# Altium project YYB_Project1.PrjPcb
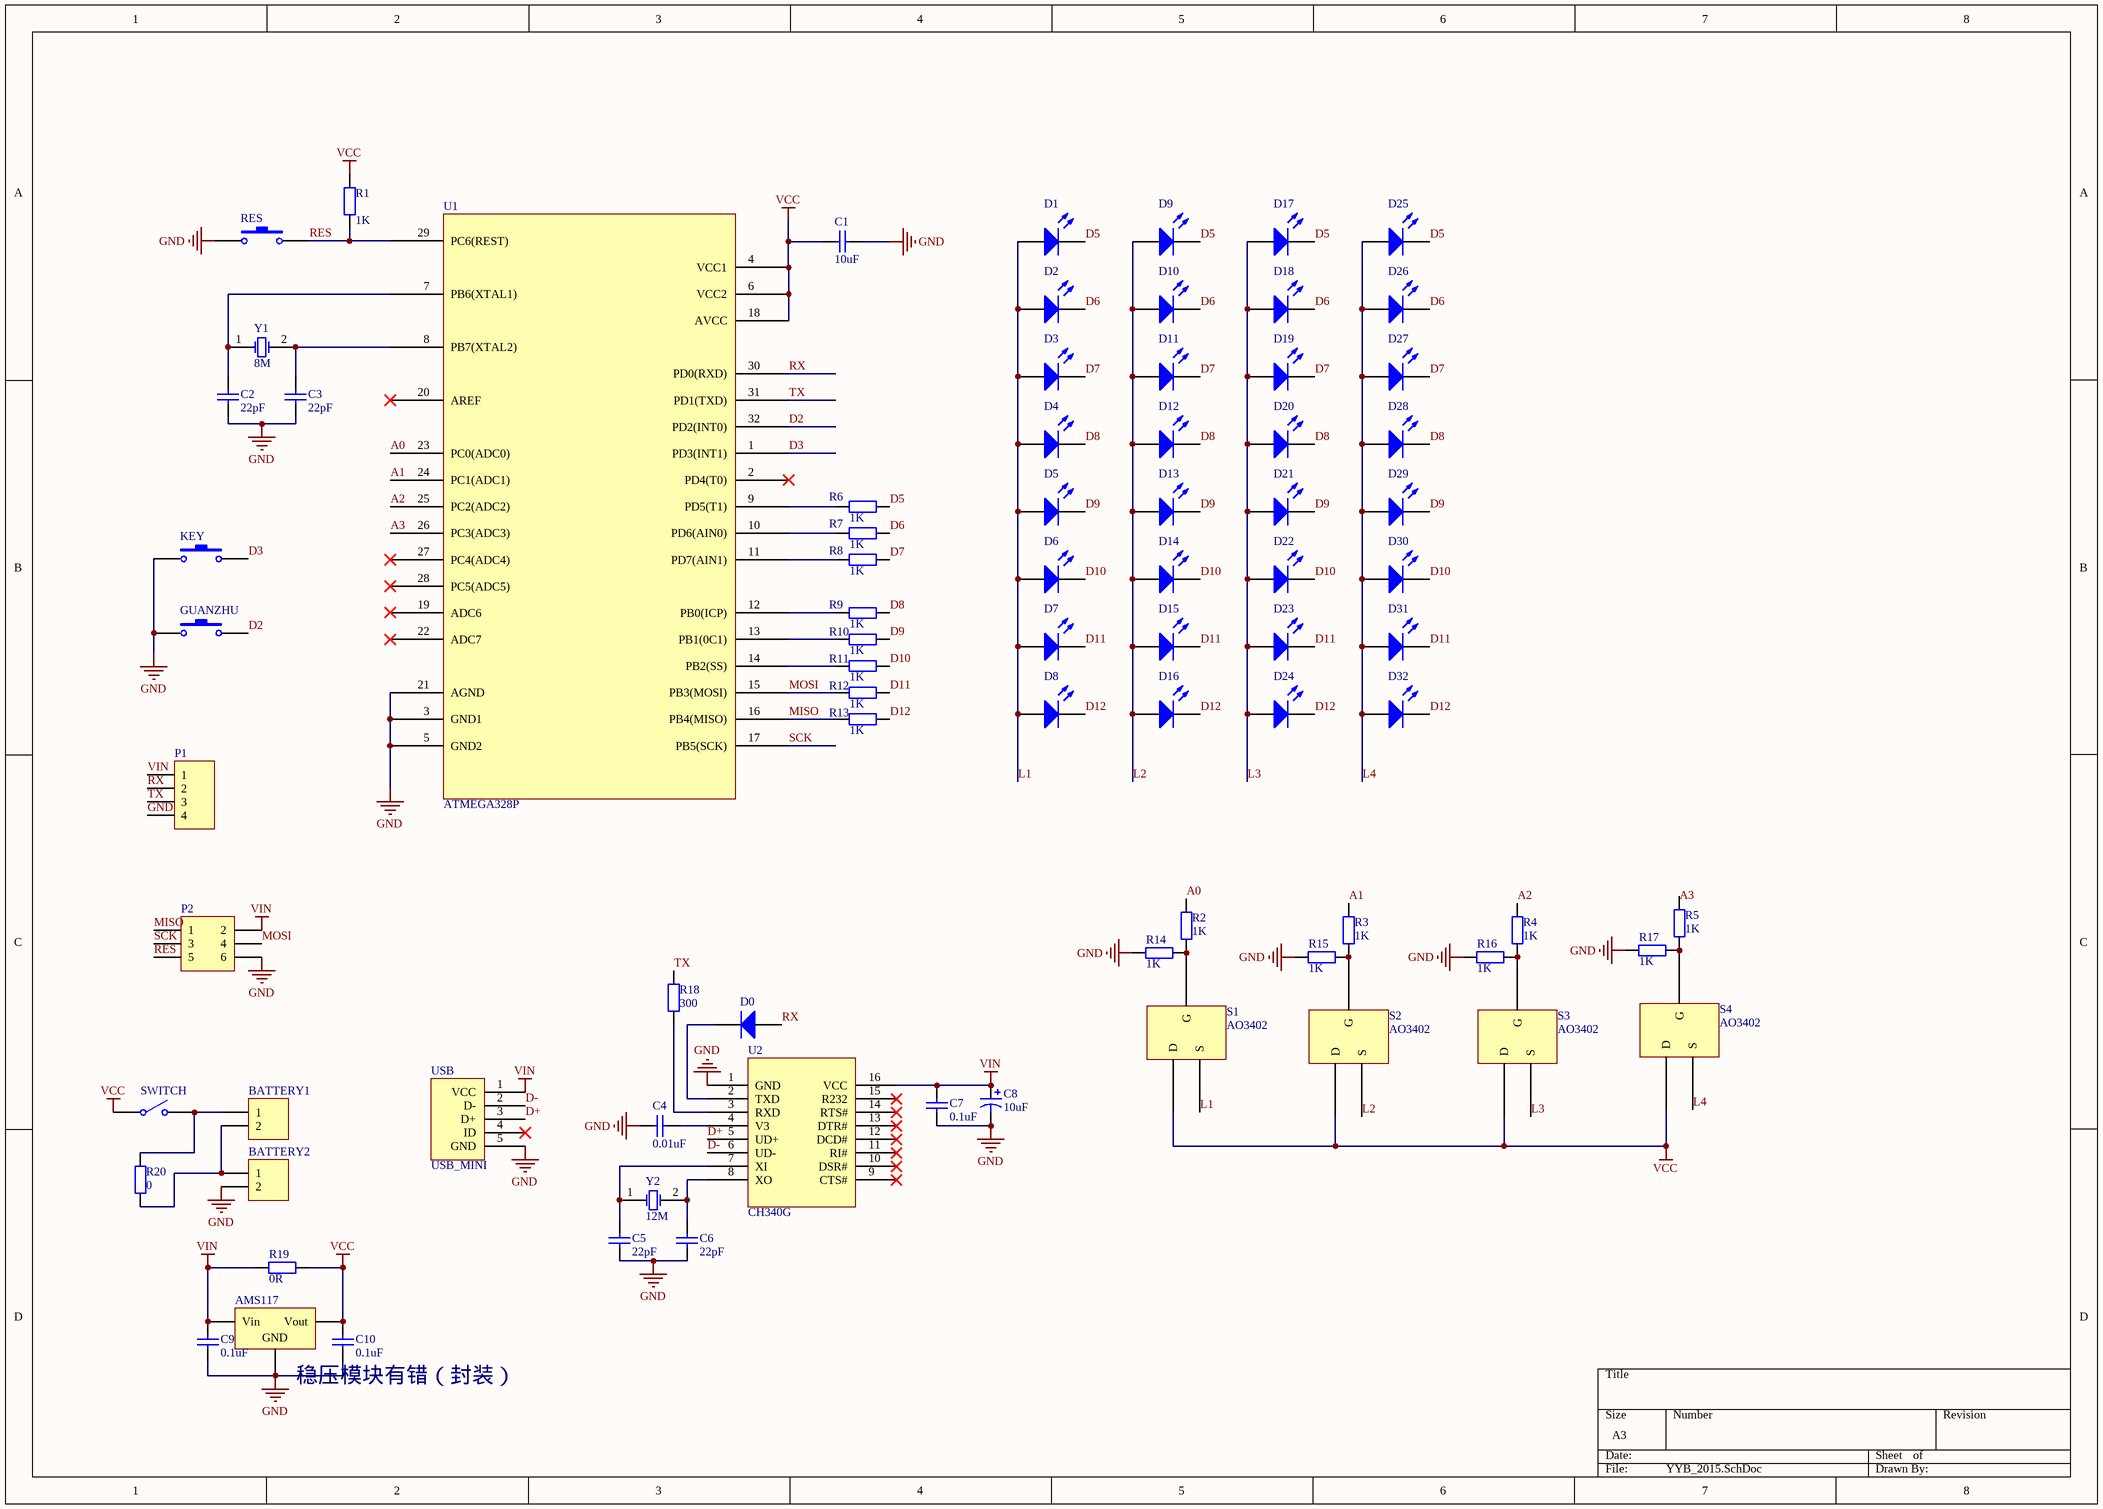
[diagram p0: YYB_2015.SchDoc]
5 sheets, 331 parts. Net scope: flat (ports and power ports of the same name join across sheets).
Board files: YYB_2015.PcbDoc, YYB_2016_2.PcbDoc, 三极管测试.PcbDoc, YYB_2016_2 电源不匹配问题解决.PcbDoc
Sheets:
  YYB_2015.SchDoc
  YYB2016_两节干电池.SchDoc
  三极管驱动电路.SchDoc
  YYB_2016_升压方案_否定.SchDoc
  YYB_供电不匹配解决.SchDoc

## Sheet YYB_2015.SchDoc
size A3

### Parts
(Parts that share a designator on the sheet are numbered #1, #2 ... from top to bottom, then left to right.)
AMS117  AMS117  [SOT223_M]  (value not drawn)
BATTERY1  Header 2  [PCBComponent_1 - duplicate1]  (value not drawn)
BATTERY2  Header 2  [PCBComponent_1 - duplicate1]  (value not drawn)
C1#1  value 10uF  [RES_0603]  (hidden comment: Cap)
C2#1  value 22pF  [RES_0603]  (hidden comment: Cap)
C3#1  value 22pF  [RES_0603]  (hidden comment: Cap)
C4  value 0.01uF  [RES_0603]  (hidden comment: Cap)
C5#1  value 22pF  [RES_0603]  (hidden comment: Cap)
C6#1  value 22pF  [RES_0603]  (hidden comment: Cap)
C7#1  value 0.1uF  [RES_0603]  (hidden comment: Cap)
C8#1  value 10uF  [10uf]  (hidden comment: Cap Pol1)
C9  value 0.1uF  [RES_0603]  (hidden comment: Cap)
C10  value 0.1uF  [RES_0603]  (hidden comment: Cap)
D0#1  Diode 1N4003  [MBR0520]  (value not drawn)
D1#1  LED0  [LED1210]  (value not drawn)
D2#1  LED0  [LED1210]  (value not drawn)
D3#1  LED0  [LED1210]  (value not drawn)
D4#1  LED0  [LED1210]  (value not drawn)
D5#1  LED0  [LED1210]  (value not drawn)
D6#1  LED0  [LED1210]  (value not drawn)
D7#1  LED0  [LED1210]  (value not drawn)
D8#1  LED0  [LED1210]  (value not drawn)
D9#1  LED0  [LED1210]  (value not drawn)
D10#1  LED0  [LED1210]  (value not drawn)
D11#1  LED0  [LED1210]  (value not drawn)
D12#1  LED0  [LED1210]  (value not drawn)
D13#1  LED0  [LED1210]  (value not drawn)
D14#1  LED0  [LED1210]  (value not drawn)
D15#1  LED0  [LED1210]  (value not drawn)
D16#1  LED0  [LED1210]  (value not drawn)
D17#1  LED0  [LED1210]  (value not drawn)
D18#1  LED0  [LED1210]  (value not drawn)
D19#1  LED0  [LED1210]  (value not drawn)
D20#1  LED0  [LED1210]  (value not drawn)
D21#1  LED0  [LED1210]  (value not drawn)
D22#1  LED0  [LED1210]  (value not drawn)
D23#1  LED0  [LED1210]  (value not drawn)
D24#1  LED0  [LED1210]  (value not drawn)
D25#1  LED0  [LED1210]  (value not drawn)
D26#1  LED0  [LED1210]  (value not drawn)
D27#1  LED0  [LED1210]  (value not drawn)
D28#1  LED0  [LED1210]  (value not drawn)
D29#1  LED0  [LED1210]  (value not drawn)
D30#1  LED0  [LED1210]  (value not drawn)
D31#1  LED0  [LED1210]  (value not drawn)
D32#1  LED0  [LED1210]  (value not drawn)
GUANZHU  SW-PB  [GUNZHU]  (value not drawn)
KEY  SW-PB  [KEY]  (value not drawn)
P1#1  Header 4  [HDR1X4]  (value not drawn)
P2  Header 3X2  [HDR2X3]  (value not drawn)
R1#1  value 1K  [RES_0603]  (hidden comment: Res2)
R2#1  value 1K  [RES_0603]  (hidden comment: Res2)
R3#1  value 1K  [RES_0603]  (hidden comment: Res2)
R4#1  value 1K  [RES_0603]  (hidden comment: Res2)
R5#1  value 1K  [RES_0603]  (hidden comment: Res2)
R6#1  value 1K  [RES_0603]  (hidden comment: Res2)
R7#1  value 1K  [RES_0603]  (hidden comment: Res2)
R8#1  value 1K  [RES_0603]  (hidden comment: Res2)
R9#1  value 1K  [RES_0603]  (hidden comment: Res2)
R10#1  value 1K  [RES_0603]  (hidden comment: Res2)
R11#1  value 1K  [RES_0603]  (hidden comment: Res2)
R12#1  value 1K  [RES_0603]  (hidden comment: Res2)
R13#1  value 1K  [RES_0603]  (hidden comment: Res2)
R14#1  value 1K  [RES_0603]  (hidden comment: Res2)
R15#1  value 1K  [RES_0603]  (hidden comment: Res2)
R16#1  value 1K  [RES_0603]  (hidden comment: Res2)
R17#1  value 1K  [RES_0603]  (hidden comment: Res2)
R18#1  value 300  [RES_0603]  (hidden comment: Res2)
R19#1  value 0R  [RES_0603]  (hidden comment: Res2)
R20#1  value 0  [RES_0603]  (hidden comment: Res2)
RES  SW-PB  [KEY]  (value not drawn)
S1  AO3402  [SOT23_M]
S2  AO3402  [SOT23_M]
S3  AO3402  [SOT23_M]
S4  AO3402  [SOT23_M]
SWITCH  SW-SPST  [SPST-2]  (value not drawn)
U1#1  ATMEGA328P  [328p]
U2#1  CH340G  [SO-16_N]
USB  USB_MINI  [USB_Micro]
Y1#1  8M  [XTAL_8M]
Y2  12M  [XTAL32_25]

### Nets
GND: AMS117.2(GND) BATTERY2.2 C1#1.2 C2#1.1 C3#1.1 C4.2 C5#1.1 C6#1.1 C7#1.1 C8#1.2 C9.1 C10.1 GUANZHU.1 KEY.1 P1#1.4 P2.6 R14#1.2 R15#1.2 R16#1.2 R17#1.2 RES.1 U1#1.3(GND1) U1#1.5(GND2) U1#1.21(AGND) U2#1.1(GND) USB.5(GND)
VCC: AMS117.3(Vout) C1#1.1 C10.2 R1#1.2 R19#1.2 S1.1(D) S2.1(D) S3.1(D) S4.1(D) SWITCH.1(COMMON) U1#1.4(VCC1) U1#1.6(VCC2) U1#1.18(AVCC)
VIN: AMS117.1(Vin) C7#1.2 C8#1.1 C9.2 P1#1.1 P2.2 R19#1.1 U2#1.16(VCC) USB.1(VCC)
A0: R2#1.2 U1#1.23(PC0(ADC0))
A1: R3#1.2 U1#1.24(PC1(ADC1))
A2: R4#1.2 U1#1.25(PC2(ADC2))
A3: U1#1.26(PC3(ADC3))
D2: GUANZHU.2 U1#1.32(PD2(INT0))
D3: KEY.2 U1#1.1(PD3(INT1))
D5: D1#1.2(K) D9#1.2(K) D17#1.2(K) D25#1.2(K) R6#1.2
D6: D2#1.2(K) D10#1.2(K) D18#1.2(K) D26#1.2(K) R7#1.2
D7: D3#1.2(K) D11#1.2(K) D19#1.2(K) D27#1.2(K) R8#1.2
D8: D4#1.2(K) D12#1.2(K) D20#1.2(K) D28#1.2(K) R9#1.2
D9: D5#1.2(K) D13#1.2(K) D21#1.2(K) D29#1.2(K) R10#1.2
D10: D6#1.2(K) D14#1.2(K) D22#1.2(K) D30#1.2(K) R11#1.2
D11: D7#1.2(K) D15#1.2(K) D23#1.2(K) D31#1.2(K) R12#1.2
D12: D8#1.2(K) D16#1.2(K) D24#1.2(K) D32#1.2(K) R13#1.2
D+: U2#1.5(UD+) USB.3(D+)
D-: U2#1.6(UD-) USB.2(D-)
L1: D1#1.1(A) D2#1.1(A) D3#1.1(A) D4#1.1(A) D5#1.1(A) D6#1.1(A) D7#1.1(A) D8#1.1(A) S1.2(S)
L2: D9#1.1(A) D10#1.1(A) D11#1.1(A) D12#1.1(A) D13#1.1(A) D14#1.1(A) D15#1.1(A) D16#1.1(A) S2.2(S)
L3: D17#1.1(A) D18#1.1(A) D19#1.1(A) D20#1.1(A) D21#1.1(A) D22#1.1(A) D23#1.1(A) D24#1.1(A) S3.2(S)
L4: D25#1.1(A) D26#1.1(A) D27#1.1(A) D28#1.1(A) D29#1.1(A) D30#1.1(A) D31#1.1(A) D32#1.1(A) S4.2(S)
MISO: P2.1 R13#1.1 U1#1.16(PB4(MISO))
MOSI: P2.4 R12#1.1 U1#1.15(PB3(MOSI))
RES: P2.5 R1#1.1 RES.2 U1#1.29(PC6(REST))
RX: D0#1.1(A) P1#1.2 U1#1.30(PD0(RXD))
SCK: P2.3 U1#1.17(PB5(SCK))
TX: P1#1.3 R18#1.1 U1#1.31(PD1(TXD))
NetBATTERY1_1: BATTERY1.1 R20#1.1 SWITCH.2(NO)
NetBATTERY1_2: BATTERY1.2 BATTERY2.1 R20#1.2
NetC2#1_2: C2#1.2 U1#1.7(PB6(XTAL1)) Y1#1.1(OSC1)
NetC3#1_2: C3#1.2 U1#1.8(PB7(XTAL2)) Y1#1.2(OSC2)
NetC4_1: C4.1 U2#1.4(V3)
NetC5#1_2: C5#1.2 U2#1.7(XI) Y2.1(OSC1)
NetC6#1_2: C6#1.2 U2#1.8(XO) Y2.2(OSC2)
NetD0#1_2: D0#1.2(K) U2#1.2(TXD)
NetR2#1_1: R2#1.1 R14#1.1 S1.3(G)
NetR3#1_1: R3#1.1 R15#1.1 S2.3(G)
NetR4#1_1: R4#1.1 R16#1.1 S3.3(G)
NetR5#1_1: R5#1.1 R17#1.1 S4.3(G)
NetR6#1_1: R6#1.1 U1#1.9(PD5(T1))
NetR7#1_1: R7#1.1 U1#1.10(PD6(AIN0))
NetR8#1_1: R8#1.1 U1#1.11(PD7(AIN1))
NetR9#1_1: R9#1.1 U1#1.12(PB0(ICP))
NetR10#1_1: R10#1.1 U1#1.13(PB1(0C1))
NetR11#1_1: R11#1.1 U1#1.14(PB2(SS))
NetR18#1_2: R18#1.2 U2#1.3(RXD)

Not connected (* = marked no-connect by the designer): R5#1 2; U1#1 2(PD4(T0))* 19(ADC6)* 20(AREF)* 22(ADC7)* 27(PC4(ADC4))* 28(PC5(ADC5))*; U2#1 9(CTS#)* 10(DSR#)* 11(RI#)* 12(DCD#)* 13(DTR#)* 14(RTS#)* 15(R232)*; USB 4(ID)*

### Notes on the sheet
- 稳压模块有错（封装）
- Labels drawn without touching a wire or pin: A3

### Library data of the parts
AMS117 = Volt Reg: Voltage Regulator; Published: 24-Mar-1999; LatestRevisionDate: 29-May-2009; LatestRevisionNote: IPC-7351 Footprint Added.; PackageReference: D2PAK; Publisher: Altium Limited; PackageDescription: 3-Pin Transistor Outline Package 2.54 mm Pitch, 15.1 mm Lead Span
BATTERY1 BATTERY2 = Header 2: Header, 2-Pin; LatestRevisionDate: 17-Jul-2002; LatestRevisionNote: Re-released for DXP Platform.; Publisher: Altium Limited
C1#1 C2#1 C3#1 C4 C5#1 C6#1 C7#1 C9 C10 = Cap: Capacitor; Published: 8-Jun-2000; LatestRevisionDate: 17-Jul-2002; LatestRevisionNote: Re-released for DXP Platform.; PackageReference: RAD-0.3; Publisher: Altium Limited; PackageDescription: Radial Cap, Thru-Hole; 2 Leads; 0.3 in Pin Spacing
C8#1 = Cap Pol1: Polarized Capacitor (Radial); Published: 8-Jun-2000; LatestRevisionDate: 17-Jul-2002; LatestRevisionNote: Re-released for DXP Platform.; PackageReference: RB7.6-15; Publisher: Altium Limited; PackageDescription: Polarized Capacitor (Radial); 2 Leads
D0#1 = Diode 1N4003: 1 Amp General Purpose Rectifier; Published: 8-Jun-2000; LatestRevisionDate: 17-Jul-2002; LatestRevisionNote: Re-released for DXP Platform.; DatasheetVersion: 1998; PackageVersion: Aug-1999; PackageReference: DO-41; Publisher: Altium Limited; PackageDescription: Diode, Axial; Body 5.2 x 2.7 mm (LxDia. max), Lead Dia. 0.86 mm (max); Code_JEDEC: DO-204-AL; ComponentLink1Description: Manufacturer Link; ComponentLink1URL: http://www.fairchildsemi.com/; ComponentLink2Description: Datasheet; ComponentLink2URL: http://www.fairchildsemi.com/ds/1N%2F1N4001.pdf
D1#1 D2#1 D3#1 D4#1 D5#1 D6#1 D7#1 D8#1 D9#1 D10#1 D11#1 D12#1 D13#1 D14#1 D15#1 D16#1 D17#1 D18#1 D19#1 D20#1 D21#1 D22#1 D23#1 D24#1 D25#1 D26#1 D27#1 D28#1 D29#1 D30#1 D31#1 D32#1 = LED0: Typical INFRARED GaAs LED; Published: 8-Jun-2000; LatestRevisionDate: 08-Jul-2005; LatestRevisionNote: Mech Layer 1 removed.; PackageReference: LED-0; Publisher: Altium Limited; PackageDescription: LED; 2 Leads
GUANZHU KEY RES = SW-PB: Switch; Published: 24-Mar-1999; LatestRevisionDate: 17-Jul-2002; LatestRevisionNote: Re-released for DXP Platform.; PackageReference: SPST-2; Publisher: Altium Limited; PackageDescription: Switch; 2 Leads
P1#1 = Header 4: Header, 4-Pin; LatestRevisionDate: 17-Jul-2002; LatestRevisionNote: Re-released for DXP Platform.; Publisher: Altium Limited
P2 = Header 3X2: Header, 3-Pin, Dual row; LatestRevisionDate: 17-Jul-2002; LatestRevisionNote: Re-released for DXP Platform.; Publisher: Altium Limited
R1#1 R2#1 R3#1 R4#1 R5#1 R6#1 R7#1 R8#1 R9#1 R10#1 R11#1 R12#1 R13#1 R14#1 R15#1 R16#1 R17#1 R18#1 R19#1 R20#1 = Res2: Resistor; Published: 8-Jun-2000; LatestRevisionDate: 17-Jul-2002; LatestRevisionNote: Re-released for DXP Platform.; PackageReference: AXIAL-0.4; Publisher: Altium Limited; PackageDescription: Axial Device, Thru-Hole; 2 Leads; 0.4 in Pin Spacing
SWITCH = SW-SPST: Single-Pole, Single-Throw Switch; Published: 24-Mar-1999; LatestRevisionDate: 17-Jul-2002; LatestRevisionNote: Re-released for DXP Platform.; PackageReference: SPST-2; Publisher: Altium Limited; PackageDescription: Switch; 2 Leads
Y1#1 Y2 = XTAL: Crystal Oscillator; Published: 8-Jun-2000; LatestRevisionDate: 17-Jul-2002; LatestRevisionNote: Re-released for DXP Platform.; PackageReference: R38; Publisher: Altium Limited; PackageDescription: Crystal, Thru-Hole; 2 Leads; Body 3.1 x 8.2 mm (Dia.xH)

## Sheet YYB2016_两节干电池.SchDoc
size A4
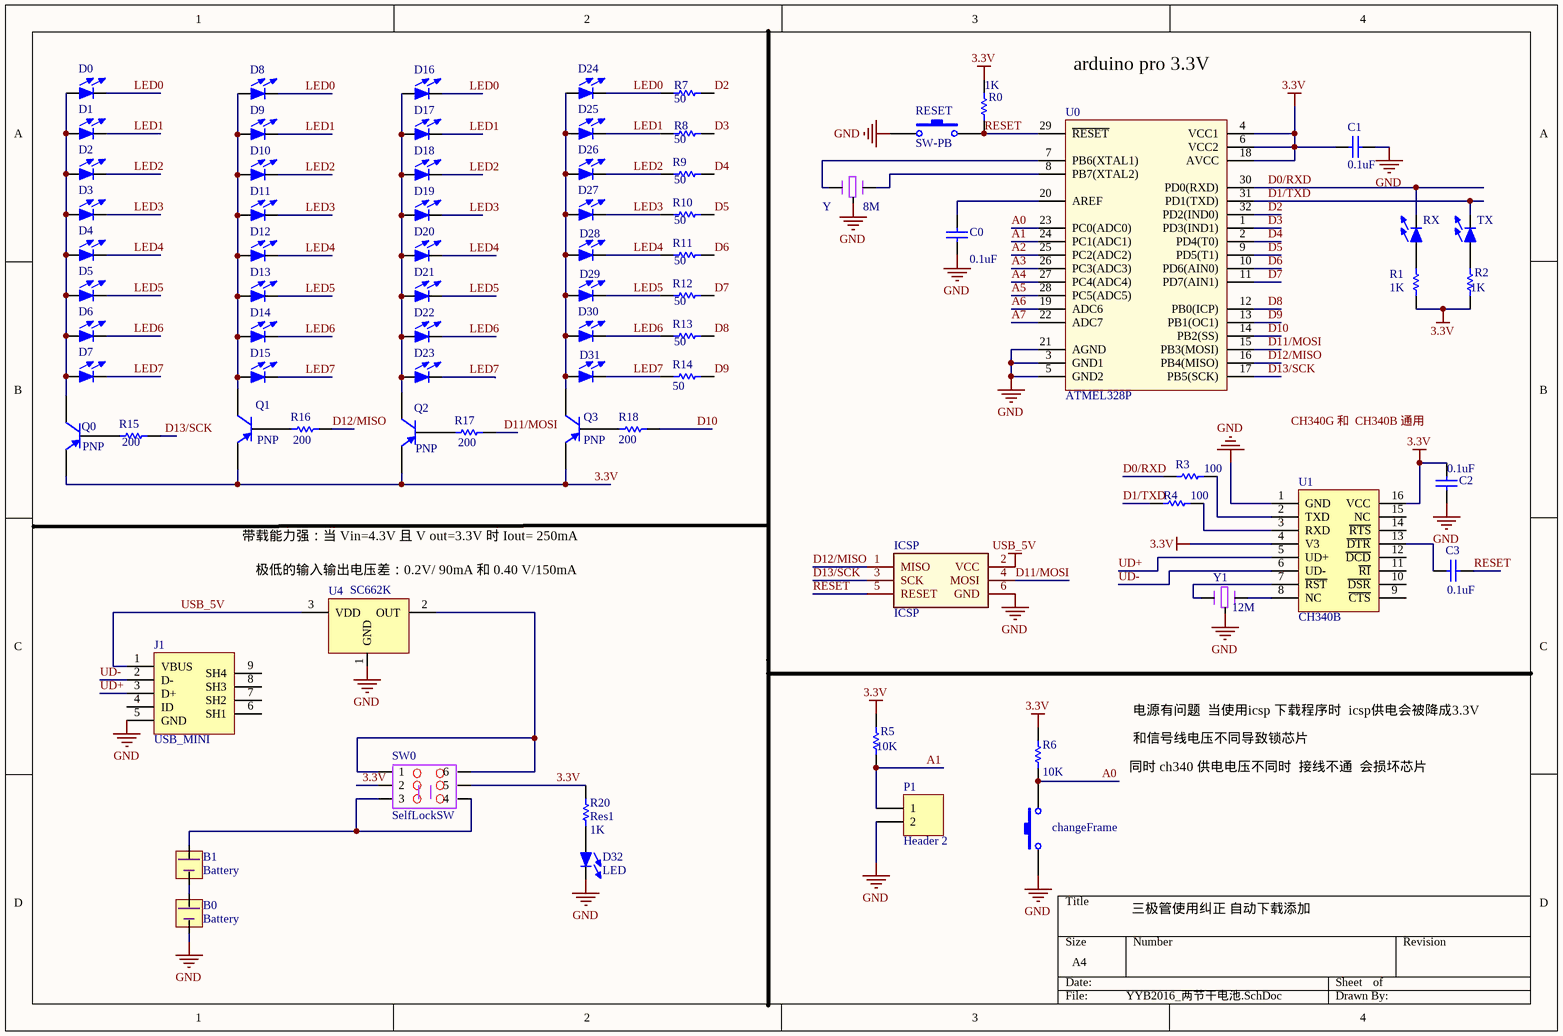
[diagram p1: YYB2016_两节干电池.SchDoc]

### Parts
(Parts that share a designator on the sheet are numbered #1, #2 ... from top to bottom, then left to right.)
B0#1  Battery  [BAT]
B1#1  Battery  [BAT]
C0#1  value 0.1uF  [6-0805_N]
C1#2  value 0.1uF  [6-0805_N]  (hidden comment: Cap)
C2#2  value 0.1uF  [6-0805_N]  (hidden comment: Cap)
C3#2  value 0.1uF  [6-0805_N]  (hidden comment: Cap)
changeFrame#1  SW-PB  [KEY_SODFL_2-Leads]  (value not drawn)
D0#2  (no value)  [LED_3528]
D1#2  (no value)  [LED_3528]
D2#2  (no value)  [LED_3528]
D3#2  (no value)  [LED_3528]
D4#2  (no value)  [LED_3528]
D5#2  (no value)  [LED_3528]
D6#2  (no value)  [LED_3528]
D7#2  (no value)  [LED_3528]
D8#2  (no value)  [LED_3528]
D9#2  (no value)  [LED_3528]
D10#2  (no value)  [LED_3528]
D11#2  (no value)  [LED_3528]
D12#2  (no value)  [LED_3528]
D13#2  (no value)  [LED_3528]
D14#2  (no value)  [LED_3528]
D15#2  (no value)  [LED_3528]
D16#2  (no value)  [LED_3528]
D17#2  (no value)  [LED_3528]
D18#2  (no value)  [LED_3528]
D19#2  (no value)  [LED_3528]
D20#2  (no value)  [LED_3528]
D21#2  (no value)  [LED_3528]
D22#2  (no value)  [LED_3528]
D23#2  (no value)  [LED_3528]
D24#2  (no value)  [LED_3528]
D25#2  (no value)  [LED_3528]
D26#2  (no value)  [LED_3528]
D27#2  (no value)  [LED_3528]
D28#2  (no value)  [LED_3528]
D29#2  (no value)  [LED_3528]
D30#2  (no value)  [LED_3528]
D31#2  (no value)  [LED_3528]
D32#2  LED  [LED_0805]
ICSP#1  ICSP  [HDR2X3]
J1#1  USB_MINI  [MICRO_USB]
P1#2  Header 2  [HDR1X2]
Q0#1  PNP  [PNP_SOT_23]
Q1#1  PNP  [PNP_SOT_23]
Q2#1  PNP  [PNP_SOT_23]
Q3#1  PNP  [PNP_SOT_23]
R0#1  value 1K  [6-0805_N]
R1#2  value 1K  [6-0805_N]  (hidden comment: Res1)
R2#2  value 1K  [6-0805_N]  (hidden comment: Res1)
R3#2  value 100  [6-0805_N]  (hidden comment: Res1)
R4#2  value 100  [6-0805_N]  (hidden comment: Res1)
R5#2  value 10K  [6-0805_N]  (hidden comment: Res1)
R6#2  value 10K  [6-0805_N]  (hidden comment: Res1)
R7#2  value 50  [6-0805_N]  (hidden comment: Res1)
R8#2  value 50  [6-0805_N]  (hidden comment: Res1)
R9#2  value 50  [6-0805_N]  (hidden comment: Res1)
R10#2  value 50  [6-0805_N]  (hidden comment: Res1)
R11#2  value 50  [6-0805_N]  (hidden comment: Res1)
R12#2  value 50  [6-0805_N]  (hidden comment: Res1)
R13#2  value 50  [6-0805_N]  (hidden comment: Res1)
R14#2  value 50  [6-0805_N]  (hidden comment: Res1)
R15#2  value 200  [6-0805_N]  (hidden comment: Res1)
R16#2  value 200  [6-0805_N]  (hidden comment: Res1)
R17#2  value 200  [6-0805_N]  (hidden comment: Res1)
R18#2  value 200  [6-0805_N]  (hidden comment: Res1)
R20#2  Res1  value 1K  [6-0805_N]
RESET#1  SW-PB  [KEY_SODFL_2-Leads]
RX#1  (no value)  [LED_0805]
SW0#1  SelfLockSW  [KEY_ZS_5.8*5.8]
TX#1  (no value)  [LED_0805]
U0#1  ATMEL328P  [TQFP 32]
U1#2  CH340B  [SOP16]
U4#1  SC662K  [SOT-23]
Y1#2  12M  [XTAL]
Y#1  8M  [XTAL]

### Nets
3.3V: C1#2.2 C2#2.2 Q0#1.2(E) Q1#1.2(E) Q2#1.2(E) Q3#1.2(E) R0#1.1 R1#2.1 R2#2.1 R5#2.2 R6#2.2 R20#2.2 SW0#1.2 SW0#1.5 U0#1.4(VCC1) U0#1.6(VCC2) U0#1.18(AVCC) U1#2.4(V3) U1#2.16(VCC)
GND: B0#1.2 C0#1.1 C1#2.1 C2#2.1 changeFrame#1.1 D32#2.2 ICSP#1.6(GND) J1#1.5(GND) P1#2.2 RESET#1.1 U0#1.3(GND1) U0#1.5(GND2) U0#1.21(AGND) U1#2.1(GND) U4#1.1(GND) Y1#2.2 Y#1.2
USB_5V: ICSP#1.2(VCC) J1#1.1(VBUS) U4#1.3(VDD)
A0: changeFrame#1.2 R6#2.1 U0#1.23(PC0(ADC0))
A1: P1#2.1 R5#2.1 U0#1.24(PC1(ADC1))
A2: U0#1.25(PC2(ADC2))
A3: U0#1.26(PC3(ADC3))
A4: U0#1.27(PC4(ADC4))
A5: U0#1.28(PC5(ADC5))
A6: U0#1.19(ADC6)
A7: U0#1.22(ADC7)
D0/RXD: R3#2.1 RX#1.2 U0#1.30(PD0(RXD))
D1/TXD: R4#2.1 TX#1.2 U0#1.31(PD1(TXD))
D2: R7#2.2 U0#1.32(PD2(IND0))
D3: R8#2.2 U0#1.1(PD3(IND1))
D4: R9#2.2 U0#1.2(PD4(T0))
D5: R10#2.2 U0#1.9(PD5(T1))
D6: R11#2.2 U0#1.10(PD6(AIN0))
D7: R12#2.2 U0#1.11(PD7(AIN1))
D8: R13#2.2 U0#1.12(PB0(ICP))
D9: R14#2.2 U0#1.13(PB1(OC1))
D10: R18#2.2 U0#1.14(PB2(SS))
D11/MOSI: ICSP#1.4(MOSI) R17#2.2 U0#1.15(PB3(MOSI))
D12/MISO: ICSP#1.1(MISO) R16#2.2 U0#1.16(PB4(MISO))
D13/SCK: ICSP#1.3(SCK) R15#2.2 U0#1.17(PB5(SCK))
LED0: D0#2.2 D8#2.2 D16#2.2 D24#2.2 R7#2.1
LED1: D1#2.2 D9#2.2 D17#2.2 D25#2.2 R8#2.1
LED2: D2#2.2 D10#2.2 D18#2.2 D26#2.2 R9#2.1
LED3: D3#2.2 D11#2.2 D19#2.2 D27#2.2 R10#2.1
LED4: D4#2.2 D12#2.2 D20#2.2 D28#2.2 R11#2.1
LED5: D5#2.2 D13#2.2 D21#2.2 D29#2.2 R12#2.1
LED6: D6#2.2 D14#2.2 D22#2.2 D30#2.2 R13#2.1
LED7: D7#2.2 D15#2.2 D23#2.2 D31#2.2 R14#2.1
RESET: C3#2.2 ICSP#1.5(RESET) R0#1.2 RESET#1.2 U0#1.29(~{RESET})
UD+: J1#1.3(D+) U1#2.5(UD+)
UD-: J1#1.2(D-) U1#2.6(UD-)
NetB0#1_1: B0#1.1(+) B1#1.2
NetB1#1_1: B1#1.1(+) SW0#1.3 SW0#1.4
NetC0#1_2: C0#1.2 U0#1.20(AREF)
NetC3#2_1: C3#2.1 U1#2.13(~{DTR})
NetD0#2_1: D0#2.1 D1#2.1 D2#2.1 D3#2.1 D4#2.1 D5#2.1 D6#2.1 D7#2.1 Q0#1.3(C)
NetD8#2_1: D8#2.1 D9#2.1 D10#2.1 D11#2.1 D12#2.1 D13#2.1 D14#2.1 D15#2.1 Q1#1.3(C)
NetD16#2_1: D16#2.1 D17#2.1 D18#2.1 D19#2.1 D20#2.1 D21#2.1 D22#2.1 D23#2.1 Q2#1.3(C)
NetD24#2_1: D24#2.1 D25#2.1 D26#2.1 D27#2.1 D28#2.1 D29#2.1 D30#2.1 D31#2.1 Q3#1.3(C)
NetD32#2_1: D32#2.1 R20#2.1
NetQ0#1_1: Q0#1.1(B) R15#2.1
NetQ1#1_1: Q1#1.1(B) R16#2.1
NetQ2#1_1: Q2#1.1(B) R17#2.1
NetQ3#1_1: Q3#1.1(B) R18#2.1
NetR1#2_2: R1#2.2 RX#1.1
NetR2#2_2: R2#2.2 TX#1.1
NetR3#2_2: R3#2.2 U1#2.2(TXD)
NetR4#2_2: R4#2.2 U1#2.3(RXD)
NetSW0#1_1: SW0#1.1 SW0#1.6 U4#1.2(OUT)
NetU0#1_7: U0#1.7(PB6(XTAL1)) Y#1.1
NetU0#1_8: U0#1.8(PB7(XTAL2)) Y#1.3
NetU1#2_7: U1#2.7(~{RST}) Y1#2.1
NetU1#2_8: U1#2.8(NC) Y1#2.3

Not connected (* = marked no-connect by the designer): J1#1 4(ID) 6(SH1) 7(SH2) 8(SH3) 9(SH4); U1#2 9(~{CTS}) 10(~{DSR}) 11(~{RI}) 12(~{DCD}) 14(~{RTS}) 15(NC)

### Notes on the sheet
- arduino pro 3.3V
- 带载能力强：当 Vin=4.3V 且 V out=3.3V 时 Iout= 250mA
- (near U4#1) 极低的输入输出电压差：0.2V/ 90mA 和 0.40 V/150mA
- 电源有问题  当使用icsp 下载程序时  icsp供电会被降成3.3V
- 同时 ch340 供电电压不同时  接线不通  会损坏芯片
- 和信号线电压不同导致锁芯片
- 三极管使用纠正 自动下载添加
- Labels drawn without touching a wire or pin: CH340G 和  CH340B 通用

### Library data of the parts
C0#1 C1#2 C2#2 C3#2 = Cap: Capacitor; Published: 8-Jun-2000; LatestRevisionDate: 17-Jul-2002; LatestRevisionNote: Re-released for DXP Platform.; PackageReference: RAD-0.3; Publisher: Altium Limited; PackageDescription: Radial Cap, Thru-Hole; 2 Leads; 0.3 in Pin Spacing
changeFrame#1 RESET#1 = SW-PB: Switch; Published: 24-Mar-1999; LatestRevisionDate: 17-Jul-2002; LatestRevisionNote: Re-released for DXP Platform.; PackageReference: SPST-2; Publisher: Altium Limited; PackageDescription: Switch; 2 Leads
D0#2 D1#2 D2#2 D3#2 D4#2 D5#2 D6#2 D7#2 D8#2 D9#2 D10#2 D11#2 D12#2 D13#2 D14#2 D15#2 D16#2 D17#2 D18#2 D19#2 D20#2 D21#2 D22#2 D23#2 D24#2 D25#2 D26#2 D27#2 D28#2 D29#2 D30#2 D31#2 RX#1 TX#1 = LED
P1#2 = Header 2: Header, 2-Pin; LatestRevisionDate: 17-Jul-2002; LatestRevisionNote: Re-released for DXP Platform.; Publisher: Altium Limited
Q0#1 Q1#1 Q2#1 Q3#1 = PNP: PNP Transistor; Published: 8-Jun-2000; LatestRevisionDate: 29-May-2009; LatestRevisionNote: IPC-7351 Footprint Added.; PackageVersion: Aug-1999; PackageReference: SOT-23B; Publisher: Altium Limited; PackageDescription: 3-Pin SOT-23 Package 0.95 mm Pitch, 2.4 mm Lead Span
R0#1 R1#2 R2#2 R3#2 R4#2 R5#2 R6#2 R7#2 R8#2 R9#2 R10#2 R11#2 R12#2 R13#2 R14#2 R15#2 R16#2 R17#2 R18#2 R20#2 = Res1: Resistor; Published: 8-Jun-2000; LatestRevisionDate: 17-Jul-2002; LatestRevisionNote: Re-released for DXP Platform.; PackageReference: AXIAL-0.3; Publisher: Altium Limited; PackageDescription: Axial Device, Thru-Hole; 2 Leads; 0.3 in Pin Spacing
SW0#1 = SelfLockSwitch: 自锁开关
U0#1 = ATMEL-328P
U1#2 = CH340B: usb to uart
U4#1 = SC662k-3.3V: 3.3V 稳压芯片
Y1#2 Y#1 = XTAL

## Sheet 三极管驱动电路.SchDoc
size A4
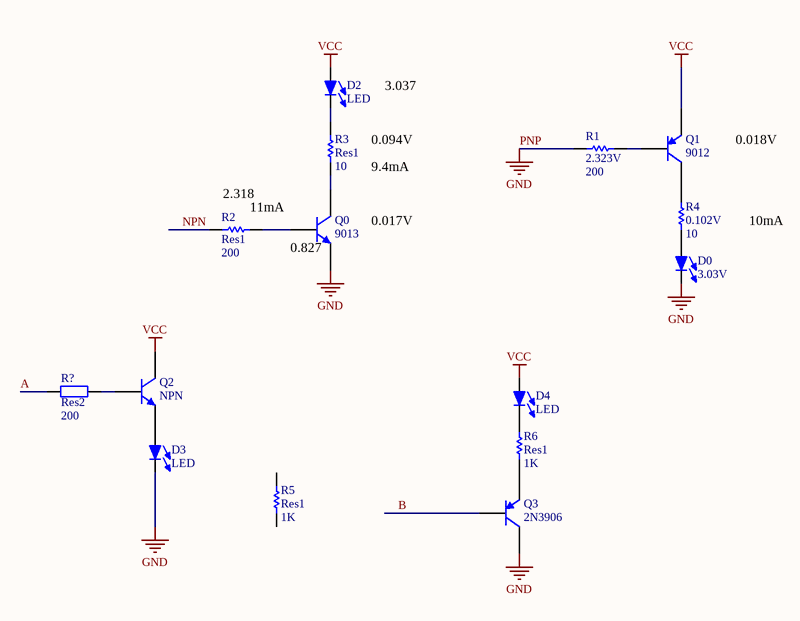
[diagram p2: 三极管驱动电路.SchDoc]

### Parts
(Parts that share a designator on the sheet are numbered #1, #2 ... from top to bottom, then left to right.)
D0#3  3.03V  [LED_3528]
D2#3  LED  [LED_3528]
D3#3  LED  [LED_3528]
D4#3  LED  [LED_3528]
Q0#2  9013  [TO-226-AA]
Q1#2  9012  [TO-92A]
Q2#2  NPN  [TO-226-AA]
Q3#2  2N3906  [TO-92A]
R1#3  2.323V  value 200  [6-0805_N]
R2#3  Res1  value 200  [6-0805_N]
R3#3  Res1  value 10  [6-0805_N]
R4#3  0.102V  value 10  [6-0805_N]
R5#3  Res1  value 1K  [6-0805_N]
R6#3  Res1  value 1K  [6-0805_N]
R?  Res2  value 200  [6-0805_N]

### Nets
GND: D0#3.2 D3#3.2 Q0#2.3(E) Q3#2.3(C) R1#3.1  [also labelled PNP]
VCC: D2#3.1 D4#3.1 Q1#2.1(E) Q2#2.1(C)
A: R?.1
B: Q3#2.2(B)
NPN: R2#3.1
NetD0#3_1: D0#3.1 R4#3.1
NetD2#3_2: D2#3.2 R3#3.2
NetD3#3_1: D3#3.1 Q2#2.3(E)
NetD4#3_2: D4#3.2 R6#3.2
NetQ0#2_1: Q0#2.1(C) R3#3.1
NetQ0#2_2: Q0#2.2(B) R2#3.2
NetQ1#2_2: Q1#2.2(B) R1#3.2
NetQ1#2_3: Q1#2.3(C) R4#3.2
NetQ2#2_2: Q2#2.2(B) R?.2
NetQ3#2_1: Q3#2.1(E) R6#3.1

Not connected (* = marked no-connect by the designer): R5#3 1 2

### Notes on the sheet
- 0.094V
- 3.037
- 0.018V
- (near R2#3) 2.318
- (near R2#3) 11mA
- 9.4mA
- (near Q0#2) 0.827
- (near Q0#2) 0.017V
- 10mA

### Library data of the parts
D0#3 = LED
Q0#2 Q2#2 = NPN: NPN Bipolar Transistor; Published: 8-Jun-2000; LatestRevisionDate: 17-Jul-2002; LatestRevisionNote: Re-released for DXP Platform.; PackageReference: TO-226-AA; Publisher: Altium Limited; PackageDescription: TO, Flat Index; 3 In-Line, Axial Leads; Body Dia. 4.8mm; Leads 0.55 x 0.51 mm (max); Code_JEDEC: TO-226-AA
Q1#2 Q3#2 = 2N3906: PNP General Purpose Amplifier; Published: 8-Jun-2000; LatestRevisionDate: 15-Jan-2003; LatestRevisionNote: PCB Footprint 'BCY-W3/D4.7' replaced; DatasheetVersion: 1997; PackageVersion: Sep-1998; PackageReference: TO-92A; Publisher: Altium Limited; PackageDescription: TO, Flat Index; 3 In-Line, Axial Leads; Body Dia. 4.5mm; Leads 0.51 x 0.48 mm (max); ComponentLink1Description: Manufacturer Link; ComponentLink1URL: http://www.fairchildsemi.com/; ComponentLink2Description: Datasheet; ComponentLink2URL: http://www.fairchildsemi.com/ds/2N%2F2N3906.pdf
R1#3 R2#3 R3#3 R4#3 R5#3 R6#3 = Res1: Resistor; Published: 8-Jun-2000; LatestRevisionDate: 17-Jul-2002; LatestRevisionNote: Re-released for DXP Platform.; PackageReference: AXIAL-0.3; Publisher: Altium Limited; PackageDescription: Axial Device, Thru-Hole; 2 Leads; 0.3 in Pin Spacing
R? = Res2: Resistor; Published: 8-Jun-2000; LatestRevisionDate: 17-Jul-2002; LatestRevisionNote: Re-released for DXP Platform.; PackageReference: AXIAL-0.4; Publisher: Altium Limited; PackageDescription: Axial Device, Thru-Hole; 2 Leads; 0.4 in Pin Spacing

## Sheet YYB_2016_升压方案_否定.SchDoc
size A4
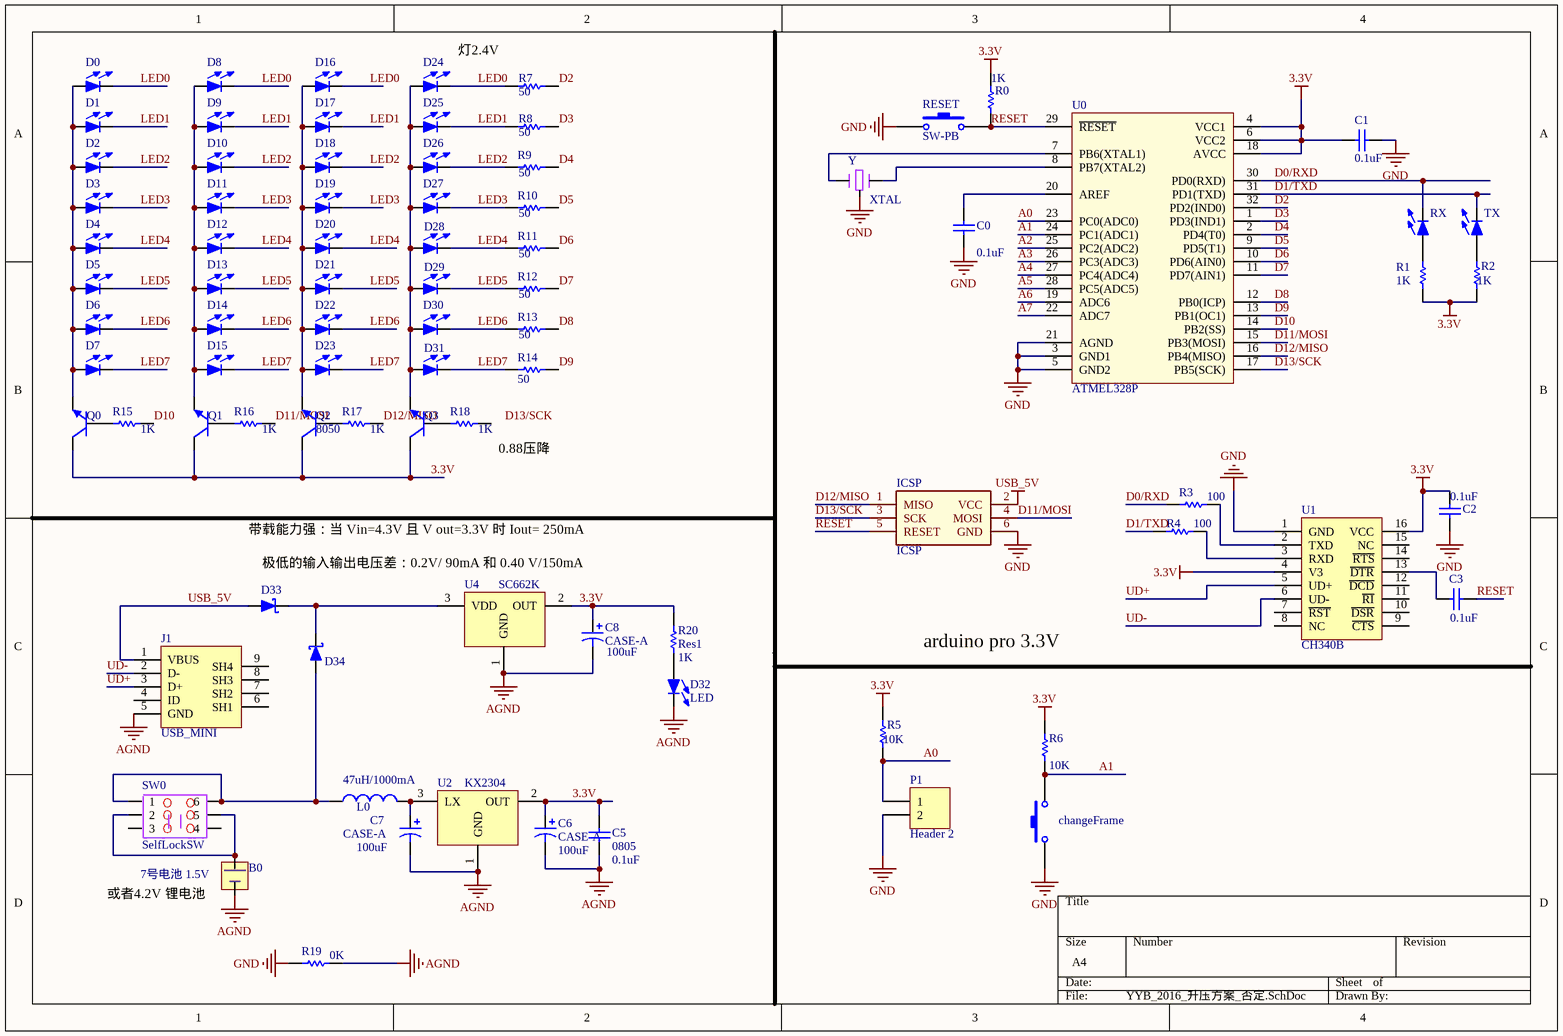
[diagram p3: YYB_2016_升压方案_否定.SchDoc]

### Parts
(Parts that share a designator on the sheet are numbered #1, #2 ... from top to bottom, then left to right.)
B0#2  7号电池 1.5V  [BAT]
C0#2  value 0.1uF  [6-0805_N]
C1#3  value 0.1uF  [6-0805_N]  (hidden comment: Cap)
C2#3  value 0.1uF  [6-0805_N]  (hidden comment: Cap)
C3#3  value 0.1uF  [6-0805_N]  (hidden comment: Cap)
C5#2  0805  value 0.1uF  [6-0805_N]
C6#2  CASE-A  value 100uF  [CASE-A_3216]
C7#2  CASE-A  value 100uF  [CASE-A_3216]
C8#2  CASE-A  value 100uF  [CASE-A_3216]
changeFrame#2  SW-PB  [KEY_SODFL_2-Leads]  (value not drawn)
D0#4  (no value)  [LED_3528]
D1#3  (no value)  [LED_3528]
D2#4  (no value)  [LED_3528]
D3#4  (no value)  [LED_3528]
D4#4  (no value)  [LED_3528]
D5#3  (no value)  [LED_3528]
D6#3  (no value)  [LED_3528]
D7#3  (no value)  [LED_3528]
D8#3  (no value)  [LED_3528]
D9#3  (no value)  [LED_3528]
D10#3  (no value)  [LED_3528]
D11#3  (no value)  [LED_3528]
D12#3  (no value)  [LED_3528]
D13#3  (no value)  [LED_3528]
D14#3  (no value)  [LED_3528]
D15#3  (no value)  [LED_3528]
D16#3  (no value)  [LED_3528]
D17#3  (no value)  [LED_3528]
D18#3  (no value)  [LED_3528]
D19#3  (no value)  [LED_3528]
D20#3  (no value)  [LED_3528]
D21#3  (no value)  [LED_3528]
D22#3  (no value)  [LED_3528]
D23#3  (no value)  [LED_3528]
D24#3  (no value)  [LED_3528]
D25#3  (no value)  [LED_3528]
D26#3  (no value)  [LED_3528]
D27#3  (no value)  [LED_3528]
D28#3  (no value)  [LED_3528]
D29#3  (no value)  [LED_3528]
D30#3  (no value)  [LED_3528]
D31#3  (no value)  [LED_3528]
D32#3  LED  [LED_0805]
D33  Diode-Schottky  [Diode-Schottky]  (value not drawn)
D34  Diode-Schottky  [Diode-Schottky]  (value not drawn)
ICSP#2  ICSP  [HDR2X3]
J1#2  USB_MINI  [MICRO_USB]
L0  value 47uH/1000mA  [0402-A]  (hidden comment: Inductor)
P1#3  Header 2  [HDR1X2]
Q0#3  transistor  [SOT-23]  (value not drawn)
Q1#3  transistor  [SOT-23]  (value not drawn)
Q2#3  8050  [SOT-23]
Q3#3  transistor  [SOT-23]  (value not drawn)
R0#2  value 1K  [6-0805_N]
R1#4  value 1K  [6-0805_N]  (hidden comment: Res1)
R2#4  value 1K  [6-0805_N]  (hidden comment: Res1)
R3#4  value 100  [6-0805_N]  (hidden comment: Res1)
R4#4  value 100  [6-0805_N]  (hidden comment: Res1)
R5#4  value 10K  [6-0805_N]  (hidden comment: Res1)
R6#4  value 10K  [6-0805_N]  (hidden comment: Res1)
R7#3  value 50  [6-0805_N]  (hidden comment: Res1)
R8#3  value 50  [6-0805_N]  (hidden comment: Res1)
R9#3  value 50  [6-0805_N]  (hidden comment: Res1)
R10#3  value 50  [6-0805_N]  (hidden comment: Res1)
R11#3  value 50  [6-0805_N]  (hidden comment: Res1)
R12#3  value 50  [6-0805_N]  (hidden comment: Res1)
R13#3  value 50  [6-0805_N]  (hidden comment: Res1)
R14#3  value 50  [6-0805_N]  (hidden comment: Res1)
R15#3  value 1K  [6-0805_N]  (hidden comment: Res1)
R16#3  value 1K  [6-0805_N]  (hidden comment: Res1)
R17#3  value 1K  [6-0805_N]  (hidden comment: Res1)
R18#3  value 1K  [6-0805_N]  (hidden comment: Res1)
R19#2  value 0K  [6-0805_N]  (hidden comment: Res1)
R20#3  Res1  value 1K  [6-0805_N]
RESET#2  SW-PB  [KEY_SODFL_2-Leads]
RX#2  (no value)  [LED_0805]
SW0#2  SelfLockSW  [KEY_ZS_8*8]
TX#2  (no value)  [LED_0805]
U0#2  ATMEL328P  [TQFP 32]
U1#3  CH340B  [SOP16]
U2#2  KX2304  [SOT89N]
U4#2  SC662K  [SOT-23]
Y#2  XTAL  [XTAL]

### Nets
3.3V: C1#3.2 C2#3.2 C5#2.2 C6#2.1 C8#2.1 Q0#3.3(C) Q1#3.3(C) Q2#3.3(C) Q3#3.3(C) R0#2.1 R1#4.1 R2#4.1 R5#4.2 R6#4.2 R20#3.2 U0#2.4(VCC1) U0#2.6(VCC2) U0#2.18(AVCC) U1#3.4(V3) U1#3.16(VCC) U2#2.2(OUT) U4#2.2(OUT)
AGND: B0#2.2 C5#2.1 C6#2.2 C7#2.2 C8#2.2 D32#3.2 J1#2.5(GND) R19#2.2 U2#2.1(GND) U4#2.1(GND)
GND: C0#2.1 C1#3.1 C2#3.1 changeFrame#2.1 ICSP#2.6(GND) P1#3.2 R19#2.1 RESET#2.1 U0#2.3(GND1) U0#2.5(GND2) U0#2.21(AGND) U1#3.1(GND) Y#2.2
USB_5V: D33.1 ICSP#2.2(VCC) J1#2.1(VBUS)
A0: P1#3.1 R5#4.1 U0#2.23(PC0(ADC0))
A1: changeFrame#2.2 R6#4.1 U0#2.24(PC1(ADC1))
A2: U0#2.25(PC2(ADC2))
A3: U0#2.26(PC3(ADC3))
A4: U0#2.27(PC4(ADC4))
A5: U0#2.28(PC5(ADC5))
A6: U0#2.19(ADC6)
A7: U0#2.22(ADC7)
D0/RXD: R3#4.1 RX#2.2 U0#2.30(PD0(RXD))
D1/TXD: R4#4.1 TX#2.2 U0#2.31(PD1(TXD))
D2: R7#3.2 U0#2.32(PD2(IND0))
D3: R8#3.2 U0#2.1(PD3(IND1))
D4: R9#3.2 U0#2.2(PD4(T0))
D5: R10#3.2 U0#2.9(PD5(T1))
D6: R11#3.2 U0#2.10(PD6(AIN0))
D7: R12#3.2 U0#2.11(PD7(AIN1))
D8: R13#3.2 U0#2.12(PB0(ICP))
D9: R14#3.2 U0#2.13(PB1(OC1))
D10: R15#3.2 U0#2.14(PB2(SS))
D11/MOSI: ICSP#2.4(MOSI) R16#3.2 U0#2.15(PB3(MOSI))
D12/MISO: ICSP#2.1(MISO) R17#3.2 U0#2.16(PB4(MISO))
D13/SCK: ICSP#2.3(SCK) U0#2.17(PB5(SCK))
LED0: D0#4.2 D8#3.2 D16#3.2 D24#3.2 R7#3.1
LED1: D1#3.2 D9#3.2 D17#3.2 D25#3.2 R8#3.1
LED2: D2#4.2 D10#3.2 D18#3.2 D26#3.2 R9#3.1
LED3: D3#4.2 D11#3.2 D19#3.2 D27#3.2 R10#3.1
LED4: D4#4.2 D12#3.2 D20#3.2 D28#3.2 R11#3.1
LED5: D5#3.2 D13#3.2 D21#3.2 D29#3.2 R12#3.1
LED6: D6#3.2 D14#3.2 D22#3.2 D30#3.2 R13#3.1
LED7: D7#3.2 D15#3.2 D23#3.2 D31#3.2 R14#3.1
RESET: C3#3.2 ICSP#2.5(RESET) R0#2.2 RESET#2.2 U0#2.29(~{RESET})
UD+: J1#2.3(D+) U1#3.5(UD+)
UD-: J1#2.2(D-) U1#3.6(UD-)
NetB0#2_1: B0#2.1(+) SW0#2.2 SW0#2.5
NetC0#2_2: C0#2.2 U0#2.20(AREF)
NetC3#3_1: C3#3.1 U1#3.13(~{DTR})
NetC7#2_1: C7#2.1 L0.2 U2#2.3(LX)
NetD0#4_1: D0#4.1 D1#3.1 D2#4.1 D3#4.1 D4#4.1 D5#3.1 D6#3.1 D7#3.1 Q0#3.2(E)
NetD8#3_1: D8#3.1 D9#3.1 D10#3.1 D11#3.1 D12#3.1 D13#3.1 D14#3.1 D15#3.1 Q1#3.2(E)
NetD16#3_1: D16#3.1 D17#3.1 D18#3.1 D19#3.1 D20#3.1 D21#3.1 D22#3.1 D23#3.1 Q2#3.2(E)
NetD24#3_1: D24#3.1 D25#3.1 D26#3.1 D27#3.1 D28#3.1 D29#3.1 D30#3.1 D31#3.1 Q3#3.2(E)
NetD32#3_1: D32#3.1 R20#3.1
NetD33_2: D33.2 D34.2 U4#2.3(VDD)
NetD34_1: D34.1 L0.1 SW0#2.1 SW0#2.6
NetQ0#3_1: Q0#3.1(B) R15#3.1
NetQ1#3_1: Q1#3.1(B) R16#3.1
NetQ2#3_1: Q2#3.1(B) R17#3.1
NetQ3#3_1: Q3#3.1(B) R18#3.1
NetR1#4_2: R1#4.2 RX#2.1
NetR2#4_2: R2#4.2 TX#2.1
NetR3#4_2: R3#4.2 U1#3.2(TXD)
NetR4#4_2: R4#4.2 U1#3.3(RXD)
NetU0#2_7: U0#2.7(PB6(XTAL1)) Y#2.1
NetU0#2_8: U0#2.8(PB7(XTAL2)) Y#2.3

Not connected (* = marked no-connect by the designer): J1#2 4(ID) 6(SH1) 7(SH2) 8(SH3) 9(SH4); R18#3 2; SW0#2 3 4; U1#3 7(~{RST}) 8(NC) 9(~{CTS}) 10(~{DSR}) 11(~{RI}) 12(~{DCD}) 14(~{RTS}) 15(NC)

### Notes on the sheet
- 灯2.4V
- (near R18#3) 0.88压降
- 带载能力强：当 Vin=4.3V 且 V out=3.3V 时 Iout= 250mA
- 极低的输入输出电压差：0.2V/ 90mA 和 0.40 V/150mA
- arduino pro 3.3V
- 或者4.2V 锂电池
- Labels drawn without touching a wire or pin: D13/SCK

### Library data of the parts
B0#2 = Battery
C0#2 C1#3 C2#3 C3#3 C5#2 = Cap: Capacitor; Published: 8-Jun-2000; LatestRevisionDate: 17-Jul-2002; LatestRevisionNote: Re-released for DXP Platform.; PackageReference: RAD-0.3; Publisher: Altium Limited; PackageDescription: Radial Cap, Thru-Hole; 2 Leads; 0.3 in Pin Spacing
C6#2 C7#2 C8#2 = Cap Pol1: Polarized Capacitor (Radial); Published: 8-Jun-2000; LatestRevisionDate: 17-Jul-2002; LatestRevisionNote: Re-released for DXP Platform.; PackageReference: RB7.6-15; Publisher: Altium Limited; PackageDescription: Polarized Capacitor (Radial); 2 Leads
changeFrame#2 RESET#2 = SW-PB: Switch; Published: 24-Mar-1999; LatestRevisionDate: 17-Jul-2002; LatestRevisionNote: Re-released for DXP Platform.; PackageReference: SPST-2; Publisher: Altium Limited; PackageDescription: Switch; 2 Leads
D0#4 D1#3 D2#4 D3#4 D4#4 D5#3 D6#3 D7#3 D8#3 D9#3 D10#3 D11#3 D12#3 D13#3 D14#3 D15#3 D16#3 D17#3 D18#3 D19#3 D20#3 D21#3 D22#3 D23#3 D24#3 D25#3 D26#3 D27#3 D28#3 D29#3 D30#3 D31#3 RX#2 TX#2 = LED
L0 = Inductor: Code_IEC: 1005; Published: 8-Jun-2000; LatestRevisionDate: 29-May-2009; LatestRevisionNote: IPC-7351 Footprint Added.; PackageReference: 0402-A; Publisher: Altium Limited; PackageDescription: Chip Inductor; Code_JEITA: 0402
P1#3 = Header 2: Header, 2-Pin; LatestRevisionDate: 17-Jul-2002; LatestRevisionNote: Re-released for DXP Platform.; Publisher: Altium Limited
Q2#3 = transistor
R0#2 R1#4 R2#4 R3#4 R4#4 R5#4 R6#4 R7#3 R8#3 R9#3 R10#3 R11#3 R12#3 R13#3 R14#3 R15#3 R16#3 R17#3 R18#3 R19#2 R20#3 = Res1: Resistor; Published: 8-Jun-2000; LatestRevisionDate: 17-Jul-2002; LatestRevisionNote: Re-released for DXP Platform.; PackageReference: AXIAL-0.3; Publisher: Altium Limited; PackageDescription: Axial Device, Thru-Hole; 2 Leads; 0.3 in Pin Spacing
SW0#2 = SelfLockSwitch: 自锁开关
U0#2 = ATMEL-328P
U1#3 = CH340B: usb to uart
U4#2 = SC662k-3.3V: 3.3V 稳压芯片

## Sheet YYB_供电不匹配解决.SchDoc
size A4
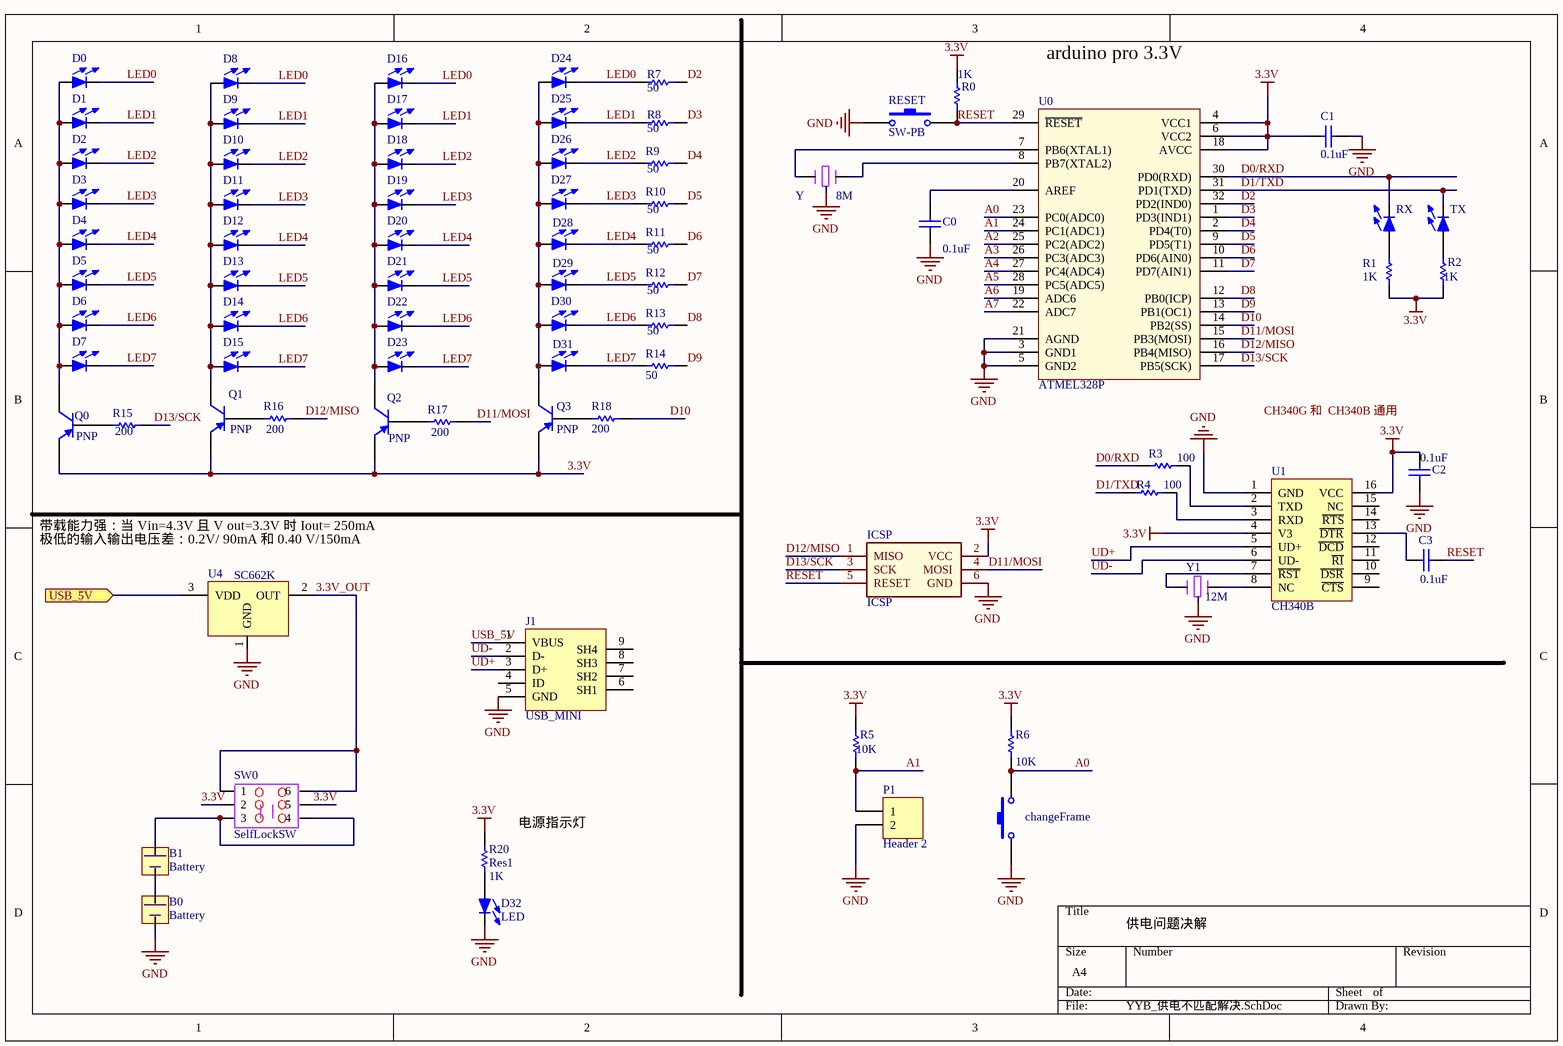
[diagram p4: YYB_供电不匹配解决.SchDoc]

### Parts
(Parts that share a designator on the sheet are numbered #1, #2 ... from top to bottom, then left to right.)
B0#3  Battery  [BAT]
B1#2  Battery  [BAT]
C0#3  value 0.1uF  [6-0805_N]
C1#4  value 0.1uF  [6-0805_N]  (hidden comment: Cap)
C2#4  value 0.1uF  [6-0805_N]  (hidden comment: Cap)
C3#4  value 0.1uF  [6-0805_N]  (hidden comment: Cap)
changeFrame#3  SW-PB  [KEY_SODFL_2-Leads]  (value not drawn)
D0#5  (no value)  [LED_3528]
D1#4  (no value)  [LED_3528]
D2#5  (no value)  [LED_3528]
D3#5  (no value)  [LED_3528]
D4#5  (no value)  [LED_3528]
D5#4  (no value)  [LED_3528]
D6#4  (no value)  [LED_3528]
D7#4  (no value)  [LED_3528]
D8#4  (no value)  [LED_3528]
D9#4  (no value)  [LED_3528]
D10#4  (no value)  [LED_3528]
D11#4  (no value)  [LED_3528]
D12#4  (no value)  [LED_3528]
D13#4  (no value)  [LED_3528]
D14#4  (no value)  [LED_3528]
D15#4  (no value)  [LED_3528]
D16#4  (no value)  [LED_3528]
D17#4  (no value)  [LED_3528]
D18#4  (no value)  [LED_3528]
D19#4  (no value)  [LED_3528]
D20#4  (no value)  [LED_3528]
D21#4  (no value)  [LED_3528]
D22#4  (no value)  [LED_3528]
D23#4  (no value)  [LED_3528]
D24#4  (no value)  [LED_3528]
D25#4  (no value)  [LED_3528]
D26#4  (no value)  [LED_3528]
D27#4  (no value)  [LED_3528]
D28#4  (no value)  [LED_3528]
D29#4  (no value)  [LED_3528]
D30#4  (no value)  [LED_3528]
D31#4  (no value)  [LED_3528]
D32#4  LED  [LED_0805]
ICSP#3  ICSP  [HDR2X3]
J1#3  USB_MINI  [MICRO_USB]
P1#4  Header 2  [HDR1X2]
Q0#4  PNP  [PNP_SOT_23]
Q1#4  PNP  [PNP_SOT_23]
Q2#4  PNP  [PNP_SOT_23]
Q3#4  PNP  [PNP_SOT_23]
R0#3  value 1K  [6-0805_N]
R1#5  value 1K  [6-0805_N]  (hidden comment: Res1)
R2#5  value 1K  [6-0805_N]  (hidden comment: Res1)
R3#5  value 100  [6-0805_N]  (hidden comment: Res1)
R4#5  value 100  [6-0805_N]  (hidden comment: Res1)
R5#5  value 10K  [6-0805_N]  (hidden comment: Res1)
R6#5  value 10K  [6-0805_N]  (hidden comment: Res1)
R7#4  value 50  [6-0805_N]  (hidden comment: Res1)
R8#4  value 50  [6-0805_N]  (hidden comment: Res1)
R9#4  value 50  [6-0805_N]  (hidden comment: Res1)
R10#4  value 50  [6-0805_N]  (hidden comment: Res1)
R11#4  value 50  [6-0805_N]  (hidden comment: Res1)
R12#4  value 50  [6-0805_N]  (hidden comment: Res1)
R13#4  value 50  [6-0805_N]  (hidden comment: Res1)
R14#4  value 50  [6-0805_N]  (hidden comment: Res1)
R15#4  value 200  [6-0805_N]  (hidden comment: Res1)
R16#4  value 200  [6-0805_N]  (hidden comment: Res1)
R17#4  value 200  [6-0805_N]  (hidden comment: Res1)
R18#4  value 200  [6-0805_N]  (hidden comment: Res1)
R20#4  Res1  value 1K  [6-0805_N]
RESET#3  SW-PB  [KEY_SODFL_2-Leads]
RX#3  (no value)  [LED_0805]
SW0#3  SelfLockSW  [KEY_ZS_5.8*5.8]
TX#3  (no value)  [LED_0805]
U0#3  ATMEL328P  [TQFP 32]
U1#4  CH340B  [SOP16]
U4#3  SC662K  [SOT-23]
Y1#3  12M  [XTAL]
Y#3  8M  [XTAL]

### Ports
USB_5V (in)

### Nets
3.3V: C1#4.2 C2#4.2 ICSP#3.2(VCC) Q0#4.2(E) Q1#4.2(E) Q2#4.2(E) Q3#4.2(E) R0#3.1 R1#5.1 R2#5.1 R5#5.2 R6#5.2 R20#4.2 SW0#3.2 SW0#3.5 U0#3.4(VCC1) U0#3.6(VCC2) U0#3.18(AVCC) U1#4.4(V3) U1#4.16(VCC)
GND: B0#3.2 C0#3.1 C1#4.1 C2#4.1 changeFrame#3.1 D32#4.2 ICSP#3.6(GND) J1#3.5(GND) P1#4.2 RESET#3.1 U0#3.3(GND1) U0#3.5(GND2) U0#3.21(AGND) U1#4.1(GND) U4#3.1(GND) Y1#3.2 Y#3.2
3.3V_OUT: SW0#3.1 SW0#3.6 U4#3.2(OUT)
A0: changeFrame#3.2 R6#5.1 U0#3.23(PC0(ADC0))
A1: P1#4.1 R5#5.1 U0#3.24(PC1(ADC1))
A2: U0#3.25(PC2(ADC2))
A3: U0#3.26(PC3(ADC3))
A4: U0#3.27(PC4(ADC4))
A5: U0#3.28(PC5(ADC5))
A6: U0#3.19(ADC6)
A7: U0#3.22(ADC7)
D0/RXD: R3#5.1 RX#3.2 U0#3.30(PD0(RXD))
D1/TXD: R4#5.1 TX#3.2 U0#3.31(PD1(TXD))
D2: R7#4.2 U0#3.32(PD2(IND0))
D3: R8#4.2 U0#3.1(PD3(IND1))
D4: R9#4.2 U0#3.2(PD4(T0))
D5: R10#4.2 U0#3.9(PD5(T1))
D6: R11#4.2 U0#3.10(PD6(AIN0))
D7: R12#4.2 U0#3.11(PD7(AIN1))
D8: R13#4.2 U0#3.12(PB0(ICP))
D9: R14#4.2 U0#3.13(PB1(OC1))
D10: R18#4.2 U0#3.14(PB2(SS))
D11/MOSI: ICSP#3.4(MOSI) R17#4.2 U0#3.15(PB3(MOSI))
D12/MISO: ICSP#3.1(MISO) R16#4.2 U0#3.16(PB4(MISO))
D13/SCK: ICSP#3.3(SCK) R15#4.2 U0#3.17(PB5(SCK))
LED0: D0#5.2 D8#4.2 D16#4.2 D24#4.2 R7#4.1
LED1: D1#4.2 D9#4.2 D17#4.2 D25#4.2 R8#4.1
LED2: D2#5.2 D10#4.2 D18#4.2 D26#4.2 R9#4.1
LED3: D3#5.2 D11#4.2 D19#4.2 D27#4.2 R10#4.1
LED4: D4#5.2 D12#4.2 D20#4.2 D28#4.2 R11#4.1
LED5: D5#4.2 D13#4.2 D21#4.2 D29#4.2 R12#4.1
LED6: D6#4.2 D14#4.2 D22#4.2 D30#4.2 R13#4.1
LED7: D7#4.2 D15#4.2 D23#4.2 D31#4.2 R14#4.1
RESET: C3#4.2 ICSP#3.5(RESET) R0#3.2 RESET#3.2 U0#3.29(~{RESET})
UD+: J1#3.3(D+) U1#4.5(UD+)
UD-: J1#3.2(D-) U1#4.6(UD-)
USB_5V: J1#3.1(VBUS)
NetB0#3_1: B0#3.1(+) B1#2.2
NetB1#2_1: B1#2.1(+) SW0#3.3 SW0#3.4
NetC0#3_2: C0#3.2 U0#3.20(AREF)
NetC3#4_1: C3#4.1 U1#4.13(~{DTR})
NetD0#5_1: D0#5.1 D1#4.1 D2#5.1 D3#5.1 D4#5.1 D5#4.1 D6#4.1 D7#4.1 Q0#4.3(C)
NetD8#4_1: D8#4.1 D9#4.1 D10#4.1 D11#4.1 D12#4.1 D13#4.1 D14#4.1 D15#4.1 Q1#4.3(C)
NetD16#4_1: D16#4.1 D17#4.1 D18#4.1 D19#4.1 D20#4.1 D21#4.1 D22#4.1 D23#4.1 Q2#4.3(C)
NetD24#4_1: D24#4.1 D25#4.1 D26#4.1 D27#4.1 D28#4.1 D29#4.1 D30#4.1 D31#4.1 Q3#4.3(C)
NetD32#4_1: D32#4.1 R20#4.1
NetQ0#4_1: Q0#4.1(B) R15#4.1
NetQ1#4_1: Q1#4.1(B) R16#4.1
NetQ2#4_1: Q2#4.1(B) R17#4.1
NetQ3#4_1: Q3#4.1(B) R18#4.1
NetR1#5_2: R1#5.2 RX#3.1
NetR2#5_2: R2#5.2 TX#3.1
NetR3#5_2: R3#5.2 U1#4.2(TXD)
NetR4#5_2: R4#5.2 U1#4.3(RXD)
NetU0#3_7: U0#3.7(PB6(XTAL1)) Y#3.1
NetU0#3_8: U0#3.8(PB7(XTAL2)) Y#3.3
NetU1#4_7: U1#4.7(~{RST}) Y1#3.1
NetU1#4_8: U1#4.8(NC) Y1#3.3
NetU4#3_3: U4#3.3(VDD) ; port USB_5V

Not connected (* = marked no-connect by the designer): J1#3 4(ID) 6(SH1) 7(SH2) 8(SH3) 9(SH4); U1#4 9(~{CTS}) 10(~{DSR}) 11(~{RI}) 12(~{DCD}) 14(~{RTS}) 15(NC)

### Notes on the sheet
- arduino pro 3.3V
- 带载能力强：当 Vin=4.3V 且 V out=3.3V 时 Iout= 250mA
- (near U4#3) 极低的输入输出电压差：0.2V/ 90mA 和 0.40 V/150mA
- (near R20#4) 电源指示灯
- 供电问题决解
- Labels drawn without touching a wire or pin: CH340G 和  CH340B 通用

### Library data of the parts
C0#3 C1#4 C2#4 C3#4 = Cap: Capacitor; Published: 8-Jun-2000; LatestRevisionDate: 17-Jul-2002; LatestRevisionNote: Re-released for DXP Platform.; PackageReference: RAD-0.3; Publisher: Altium Limited; PackageDescription: Radial Cap, Thru-Hole; 2 Leads; 0.3 in Pin Spacing
changeFrame#3 RESET#3 = SW-PB: Switch; Published: 24-Mar-1999; LatestRevisionDate: 17-Jul-2002; LatestRevisionNote: Re-released for DXP Platform.; PackageReference: SPST-2; Publisher: Altium Limited; PackageDescription: Switch; 2 Leads
D0#5 D1#4 D2#5 D3#5 D4#5 D5#4 D6#4 D7#4 D8#4 D9#4 D10#4 D11#4 D12#4 D13#4 D14#4 D15#4 D16#4 D17#4 D18#4 D19#4 D20#4 D21#4 D22#4 D23#4 D24#4 D25#4 D26#4 D27#4 D28#4 D29#4 D30#4 D31#4 RX#3 TX#3 = LED
P1#4 = Header 2: Header, 2-Pin; LatestRevisionDate: 17-Jul-2002; LatestRevisionNote: Re-released for DXP Platform.; Publisher: Altium Limited
Q0#4 Q1#4 Q2#4 Q3#4 = PNP: PNP Transistor; Published: 8-Jun-2000; LatestRevisionDate: 29-May-2009; LatestRevisionNote: IPC-7351 Footprint Added.; PackageVersion: Aug-1999; PackageReference: SOT-23B; Publisher: Altium Limited; PackageDescription: 3-Pin SOT-23 Package 0.95 mm Pitch, 2.4 mm Lead Span
R0#3 R1#5 R2#5 R3#5 R4#5 R5#5 R6#5 R7#4 R8#4 R9#4 R10#4 R11#4 R12#4 R13#4 R14#4 R15#4 R16#4 R17#4 R18#4 R20#4 = Res1: Resistor; Published: 8-Jun-2000; LatestRevisionDate: 17-Jul-2002; LatestRevisionNote: Re-released for DXP Platform.; PackageReference: AXIAL-0.3; Publisher: Altium Limited; PackageDescription: Axial Device, Thru-Hole; 2 Leads; 0.3 in Pin Spacing
SW0#3 = SelfLockSwitch: 自锁开关
U0#3 = ATMEL-328P
U1#4 = CH340B: usb to uart
U4#3 = SC662k-3.3V: 3.3V 稳压芯片
Y1#3 Y#3 = XTAL

## Nets that join several sheets
3.3V: YYB2016_两节干电池 (19 pins), YYB_2016_升压方案_否定 (22 pins), YYB_供电不匹配解决 (20 pins)
GND: YYB_2015 (26 pins), YYB2016_两节干电池 (17 pins), 三极管驱动电路 (5 pins), YYB_2016_升压方案_否定 (13 pins), YYB_供电不匹配解决 (17 pins)
USB_5V: YYB2016_两节干电池 (ICSP#1.2 J1#1.1 U4#1.3), YYB_2016_升压方案_否定 (D33.1 ICSP#2.2 J1#2.1)
VCC: YYB_2015 (13 pins), 三极管驱动电路 (D2#3.1 D4#3.1 Q1#2.1 Q2#2.1)